# EAGLE design PianoDIY (EAGLE 9.2.2)
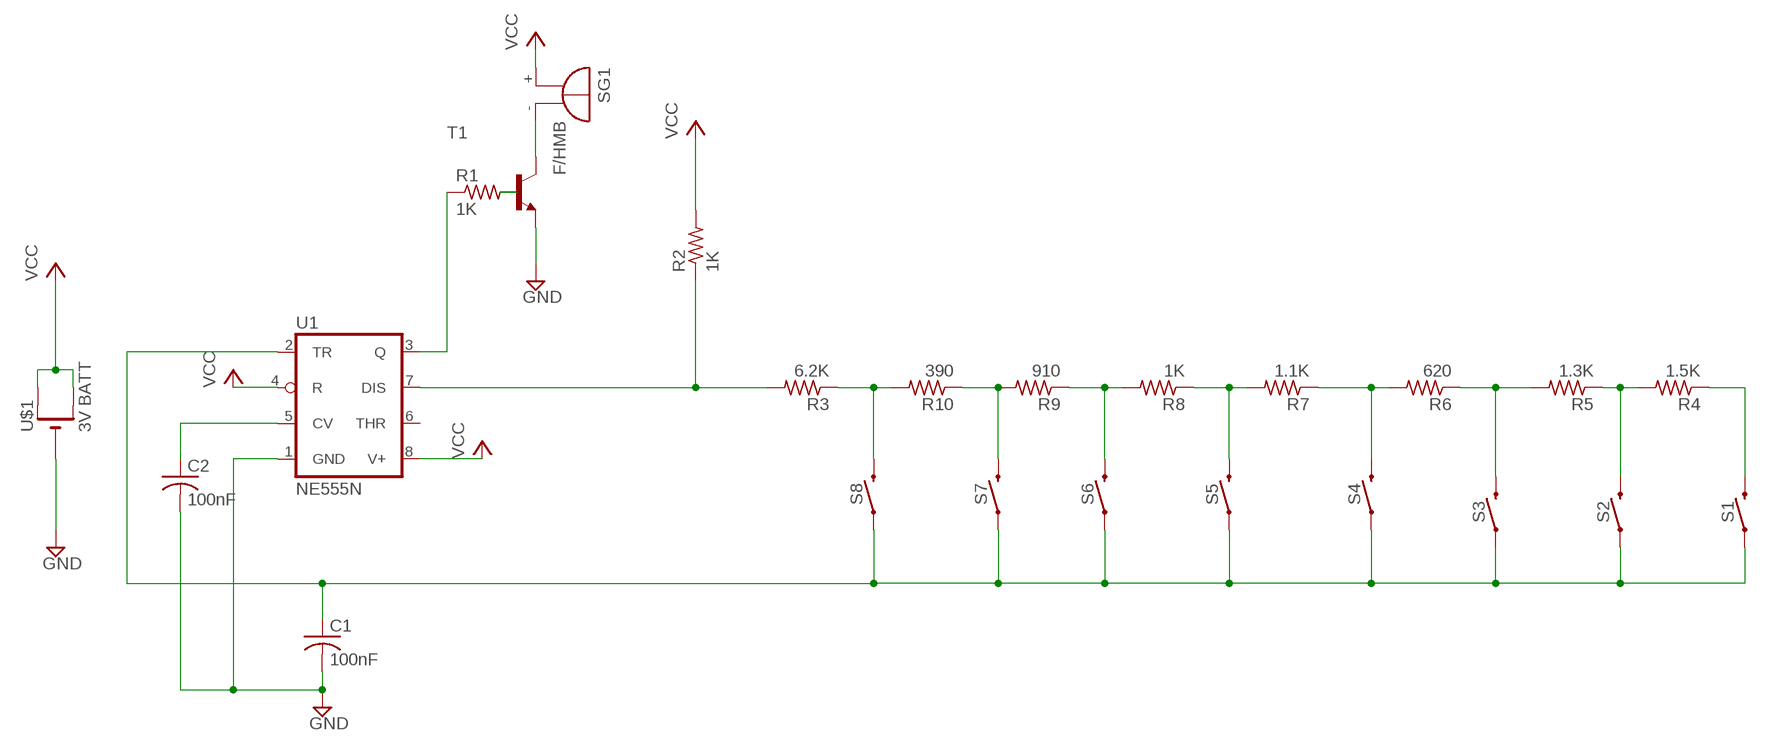
[diagram p0: schematic, sheet 1]

## Parts
C1  100nF  C-US025-025X050  [C025-025X050]
C2  100nF  C-US025-025X050  [C025-025X050]
R1  1K  R-US_0207/10  [0207/10]
R2  1K  R-US_0207/10  [0207/10]
R3  6.2K  R-US_0207/10  [0207/10]
R4  1.5K  R-US_0207/10  [0207/10]
R5  1.3K  R-US_0207/10  [0207/10]
R6  620  R-US_0207/10  [0207/10]
R7  1.1K  R-US_0207/10  [0207/10]
R8  1K  R-US_0207/10  [0207/10]
R9  910  R-US_0207/10  [0207/10]
R10  390  R-US_0207/10  [0207/10]
S1  MOMENTARY-SWITCH-SPST-PTH-6.0MM  [TACTILE_SWITCH_PTH_6.0MM]
S2  MOMENTARY-SWITCH-SPST-PTH-6.0MM  [TACTILE_SWITCH_PTH_6.0MM]
S3  MOMENTARY-SWITCH-SPST-PTH-6.0MM  [TACTILE_SWITCH_PTH_6.0MM]
S4  MOMENTARY-SWITCH-SPST-PTH-6.0MM  [TACTILE_SWITCH_PTH_6.0MM]
S5  MOMENTARY-SWITCH-SPST-PTH-6.0MM  [TACTILE_SWITCH_PTH_6.0MM]
S6  MOMENTARY-SWITCH-SPST-PTH-6.0MM  [TACTILE_SWITCH_PTH_6.0MM]
S7  MOMENTARY-SWITCH-SPST-PTH-6.0MM  [TACTILE_SWITCH_PTH_6.0MM]
S8  MOMENTARY-SWITCH-SPST-PTH-6.0MM  [TACTILE_SWITCH_PTH_6.0MM]
SG1  F/HMB  [F/HMB]
T1  -NPN-TO92-E1  [TO92-E1]
U1  NE555N  [DIL08]
U$1  3V BATT  CR1220THM  [CR1220-THM]

## Nets
GND: C1.2 C2.2 T1.3(E) U1.1(GND) U$1.-
N$1: R2.1 R3.2 U1.7(DIS)
N$2: R3.1 R10.2 S8.3
N$3: R9.2 R10.1 S7.3
N$4: R8.2 R9.1 S6.3
N$5: R7.2 R8.1 S5.3
N$6: R6.2 R7.1 S4.3
N$7: R5.2 R6.1 S3.3
N$8: R4.2 R5.1 S2.3
N$9: R4.1 S1.3
N$10: C2.1 U1.5(CV)
N$11: R1.2 T1.2(B)
N$12: R1.1 U1.3(Q)
N$13: SG1.- T1.1(C)
N$15: C1.1 S1.1 S2.1 S3.1 S4.1 S5.1 S6.1 S7.1 S8.1 U1.2(TR)
VCC: R2.2 SG1.+ U1.4(R) U1.8(V+) U$1.+1(+) U$1.+2(+1)
Unconnected: U1.6(THR)

## Library data of the parts
C1 C2 = rcl:C-US: CAPACITOR, American symbol; SPICEPREFIX: C
R1-R10 = rcl:R-US_: RESISTOR, American symbol; SPICEPREFIX: R
S1-S8 = SparkFun-Switches:MOMENTARY-SWITCH-SPST: Momentary Switch (Pushbutton) - SPST Normally-open (NO) SPST momentary switches (buttons, pushbuttons). Variants PTH-12MM - 12mm square, through-hole Momentary Pushbutton Switch - 12mm Square <https://www.sparkfun.com/products/9190> (COM-09190) PTH-6.0MM, PTH-6.0MM-KIT - 6.0mm square, through-hole Mini Pushbutton Switch <https://www.sparkfun.com/products/97> (COM-00097) KIT package intended for soldering kit's - only one side of pads' copper is exposed. PTH-RIGHT-ANGLE-KIT - Right-angle, through-hole Right Angle Tactile Button <https://www.sparkfun.com/products/10791> - Used on SparkFun BigTime Watch Kit <https://www.sparkfun.com/products/11734> SMD-12MM - 12mm square, surface-mount Tactile Button - SMD (12mm) <https://www.sparkfun.com/products/12993> (COM-12993) Used on SparkFun PicoBoard <https://www.sparkfun.com/products/11888> SMD-4.5MM - 4.5mm Square Trackball Switch Used on SparkFun Blackberry Trackballer Breakout <https://www.sparkfun.com/products/13169> SMD-4.6MMX2.8MM - 4.60mm x 2.80mm, surface mount Used on SparkFun SAMD21 Mini Breakout <https://www.sparkfun.com/products/13664> SMD-5.2MM, SMD-5.2-REDUNDANT - 5.2mm square, surface-mount Mini Pushbutton Switch - SMD <https://www.sparkfun.com/products/8720> (COM-08720) Used on Arduino Pro Mini <https://www.sparkfun.com/products/11114> REDUNDANT package connects both switch circuits together SMD-6.0X3.5MM - 6.0 x 3.5mm, surface mount Momentary Reset Switch SMD <https://www.sparkfun.com/products/8229> (COM-08229) SMD-6.2MM-TALL - 6.2mm square, surface mount Tactile Button - SMD (6mm) <https://www.sparkfun.com/products/12992> Used on SparkFun Digital Sandbox <https://www.sparkfun.com/products/12651> SMD-RIGHT-ANGLE - Right-angle, surface mount Used on SparkFun Block for Intel® Edison - Arduino <https://www.sparkfun.com/products/13036>; PROD_ID: SWCH-08441; SF_SKU: COM-00097
SG1 = buzzer:F/HMB: BUZZER Source: Buerklin; OC_FARNELL: unknown; OC_NEWARK: unknown
T1 = transistor:*-NPN-: NPN Transistror BF959 corrected 2008.03.06
U1 = linear:*555: TIMER; SPICEPREFIX: X
U$1 = adafruit:CR1220: CR1216/CR1220/CR1225 12mm 3V lithium coin cell Great for battery packup. Both SMT and THM holders. Note the THM package has the ground pads on both sides of the PCB so that the masks are the same - this reduces the cost

## Net classes
0 default: width 0.305 mm, drill 0.508 mm, clearance 0.254 mm

## Board
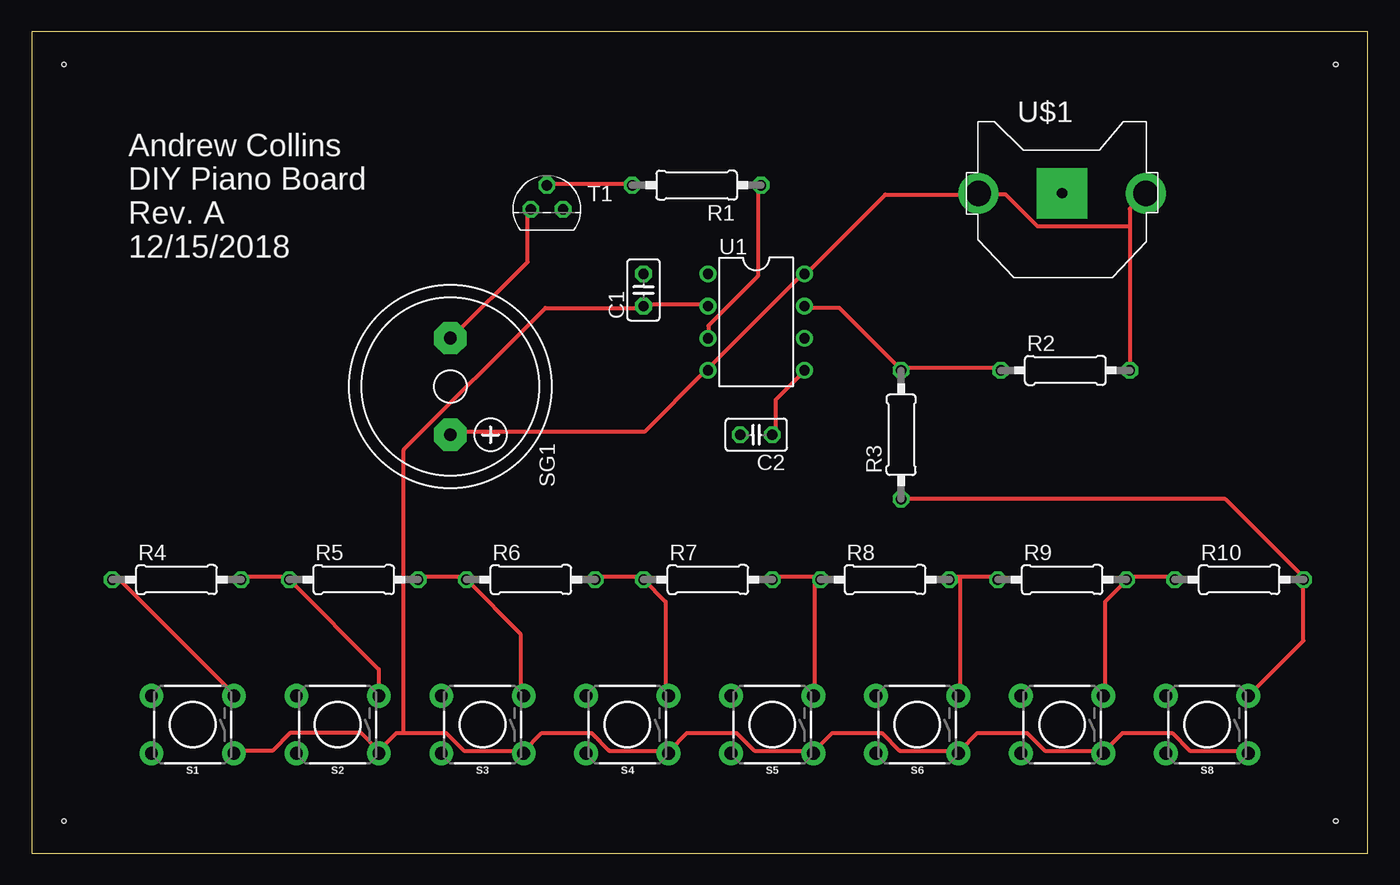
[diagram p1: board, top side]
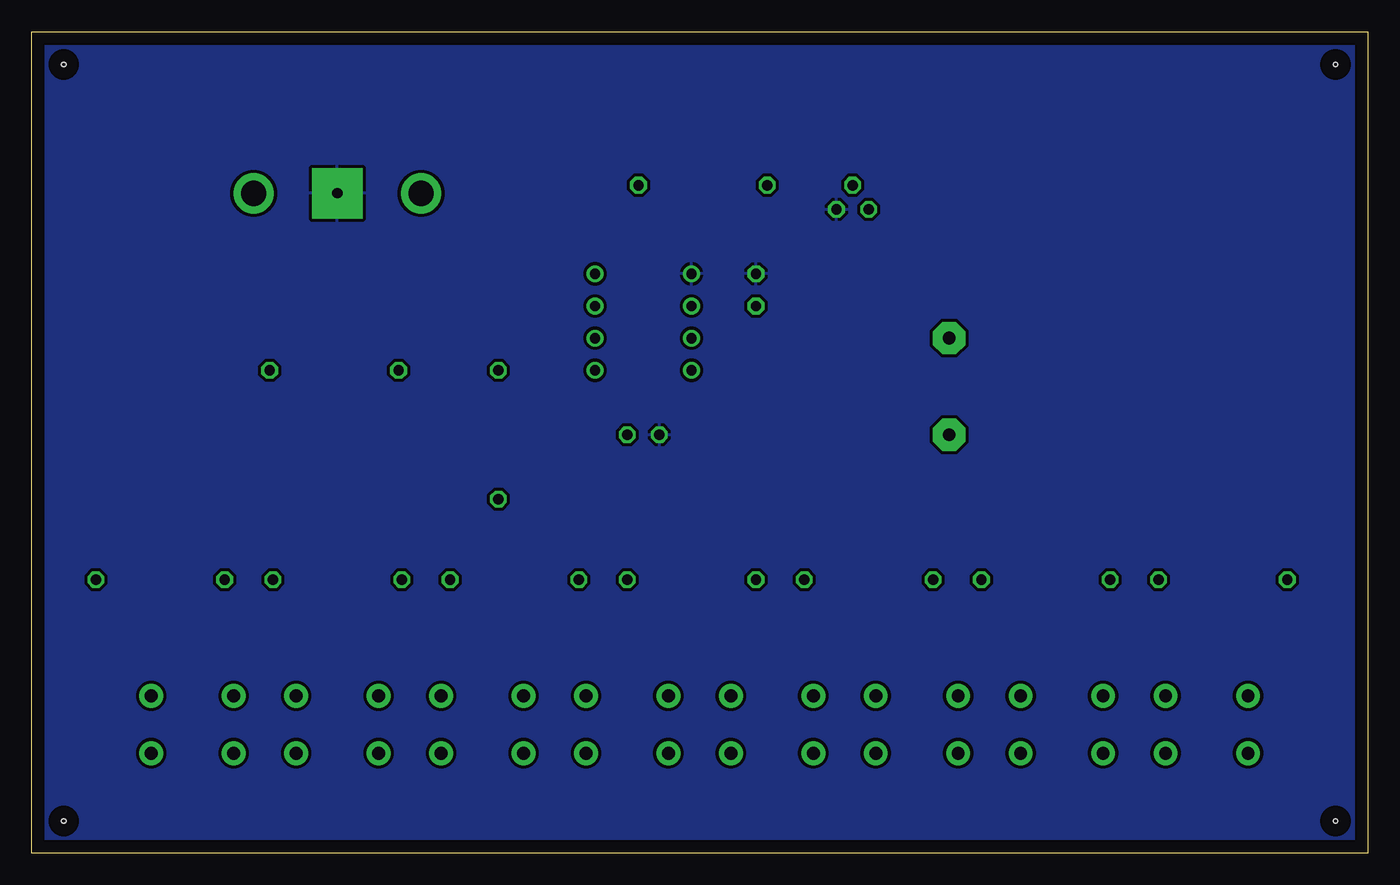
[diagram p2: board, bottom side, seen from below]

Size 105.39 x 64.82 mm. Coordinates in mm from the lower left corner, seen from the top.
Outline: 0,0 105.39,0 105.39,64.82 0,64.82 0,0
Copper layers (1*16): Top 0.035mm / dielectric 1.5mm / Bottom 0.035mm
Design rules "default": minimum track width 6mil, minimum drill 0.35mm, track to track 6mil, track to pad 6mil, pad to pad 6mil, via to via 6mil, smd to smd 6mil, copper to edge 40mil, drill to drill 6mil, minimum pad ring 10mil, minimum via ring 8mil, stop-mask expansion 4mil, vias tented up to drill 0mil, thermal gap 10mil
Holes 0.35 mm at 2.54,62.23 102.87,62.23 102.87,2.54 2.54,2.54

### Footprints (pad centres in the part's own frame; a part is rotated, then mirrored left to right if it is on the bottom)
C025-025X050 = drill 0.813 octagon: 1 -1.27,0; 2 1.27,0
0207/10 = drill 0.813 octagon: 1 -5.08,0; 2 5.08,0
TACTILE_SWITCH_PTH_6.0MM = drill 1.016 pad 1.88: 1 -3.251,2.261; 2 3.251,2.261; 3 -3.251,-2.261; 4 3.251,-2.261
F/HMB = drill 1.016 pad 2.54 octagon: + 3.81,0; - -3.81,0
TO92-E1 = drill 0.813 octagon: 1 -1.27,0; 2 0,1.905; 3 1.27,0
DIL08 = drill 0.813 pad 1.27: 1 -3.81,-3.81; 2 -1.27,-3.81; 3 1.27,-3.81; 4 3.81,-3.81; 5 3.81,3.81; 6 1.27,3.81; 7 -1.27,3.81; 8 -3.81,3.81
CR1220-THM = drill 2 pad 3.175: +1 -6.604,0; +2 6.604,0 | drill 0.8 pad 3.962 square: - 0,0

### Placement (x,y rotation side)
C1  48.26,44.45 90 top
C2  57.15,33.02 180 top
R1  52.45,52.7 180 top
R2  81.53,38.1 0 top
R3  68.58,33.02 90 top
R4  11.43,21.59 0 top
R5  25.4,21.59 0 top
R6  39.37,21.59 0 top
R7  53.34,21.59 0 top
R8  67.31,21.59 0 top
R9  81.28,21.59 0 top
R10  95.25,21.59 0 top
S1  12.7,10.16 180 top
S2  24.13,10.16 180 top
S3  35.56,10.16 180 top
S4  46.99,10.16 180 top
S5  58.42,10.16 180 top
S6  69.85,10.16 180 top
S7  81.28,10.16 180 top
S8  92.71,10.16 180 top
SG1  33.02,36.83 270 top
T1  40.64,50.8 0 top
U1  57.15,41.91 270 top
U$1  81.28,52.07 0 top

### Tracks (layer width: path | path; a pad name or v marks a point on that pad's centre or on a via)
GND
  pour Bottom: 0,64.77 105.41,64.77 105.41,0 0,0
N$1
  Top 0.305: R2.1 76.28,38.28 68.73,38.28 R3.2 68.45,38.28 63.7,43.03 61.19,43.03 U1.7
N$2
  Top 0.305: S8.3 100.31,16.76 100.31,21.51 R10.2 100.31,21.79 94.16,27.94 R3.1
N$3
  Top 0.305: R10.1 89.97,21.79 86.61,21.79 R9.2 86.33,21.51 84.66,19.84 84.66,12.57 S7.3
N$4
  Top 0.305: 73.2,21.79 76,21.79 R9.1 | 73.2,21.79 72.64,21.79 R8.2 | 73.2,21.79 73.2,12.57 S6.3
N$5
  Top 0.305: 61.75,21.79 62.03,21.79 R8.1 61.75,21.79 | 61.75,21.79 58.67,21.79 R7.2 | 61.75,21.79 61.75,12.57 S5.3
N$6
  Top 0.305: R6.2 44.7,21.79 48.06,21.79 R7.1 50.01,19.84 50.01,12.57 S4.3
N$7
  Top 0.305: R5.2 30.73,21.79 34.09,21.79 R6.1 38.56,17.32 38.56,12.57 S3.3
N$8
  Top 0.305: R4.2 16.76,21.79 20.12,21.79 R5.1 27.38,14.53 S2.3
N$9
  Top 0.305: R4.1 6.43,21.51 6.99,21.51 15.93,12.57 S1.3
N$10
  Top 0.305: C2.1 58.67,33.25 58.67,35.76 60.91,38 U1.5
N$11
  Top 0.305: T1.2 40.79,52.81 47.22,52.81 R1.2
N$12
  Top 0.305: U1.3 53.37,40.79 53.37,41.63 57.28,45.54 57.28,52.53 R1.1
N$13
  Top 0.305: T1.1 39.12,50.57 39.12,46.66 33.25,40.79 SG1.-
N$15
  Top 0.305: U1.2 53.09,43.31 48.34,43.31 C1.1 48.06,43.03 40.51,43.03 29.34,31.85 29.34,9.5 | 27.38,8.1 25.98,9.5 20.4,9.5 19,8.1 16.2,8.1 S1.1 | 29.34,9.5 28.78,9.5 27.38,8.1 | 29.34,9.5 32.69,9.5 34.09,8.1 38.56,8.1 S3.1 38.84,8.1 40.23,9.5 44.15,9.5 45.54,8.1 50.01,8.1 S4.1 50.29,8.1 51.69,9.5 55.6,9.5 57,8.1 61.47,8.1 S5.1 61.75,8.1 63.14,9.5 67.06,9.5 68.45,8.1 72.92,8.1 S6.1 73.2,8.1 74.6,9.5 78.51,9.5 79.91,8.1 84.38,8.1 S7.1 84.66,8.1 86.06,9.5 89.97,9.5 91.36,8.1 95.83,8.1 S8.1 | 27.38,8.1 S2.1
VCC
  Top 0.305: 86.61,49.45 86.61,50.85 87.73,51.97 U$1.+2 | 86.61,49.45 R2.2 | 86.61,49.45 79.35,49.45 76.83,51.97 74.88,51.97 U$1.+1 74.6,51.97 67.33,51.97 61.19,45.82 U1.8 60.91,45.82 53.37,38.28 U1.4 53.09,38 48.34,33.25 33.25,33.25 SG1.+

### Text on the board
tPlace: Andrew Collins / DIY Piano Board / Rev. A / 12/15/2018